# EAGLE design dds (EAGLE 7.7.0)

## Sheet 1 of 2
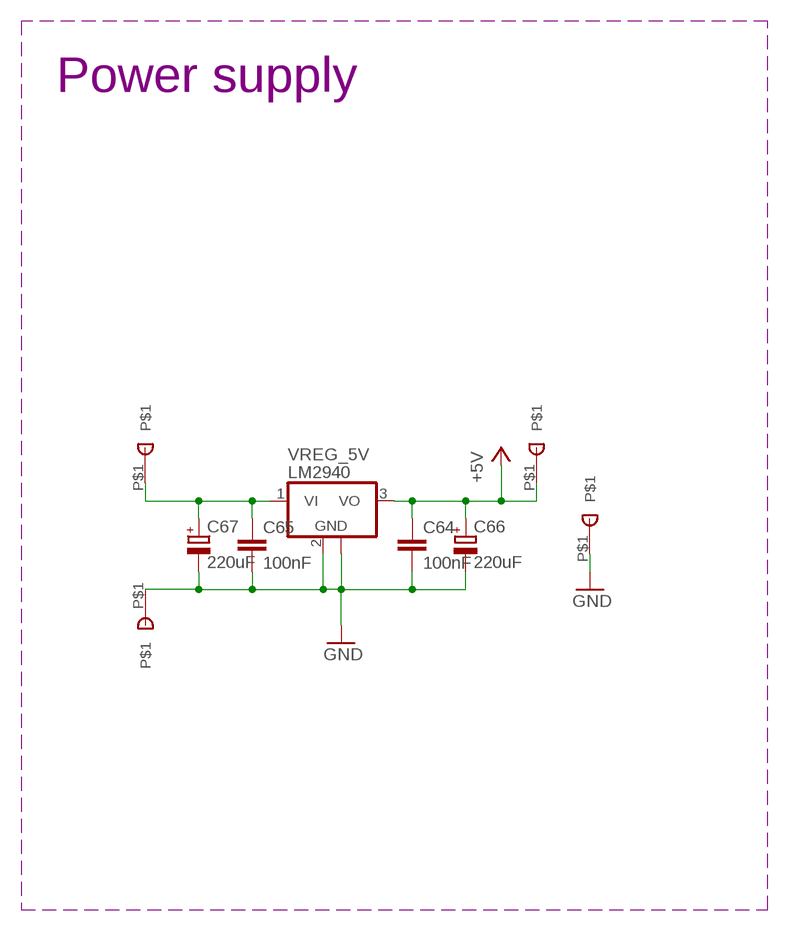
[diagram p0: schematic, sheet 1]

### Parts
C64  100nF  C-EUC0603  [C0603]
C65  100nF  C-EUC0603  [C0603]
C66  220uF  CPOL-EUCT7343  [CT7343]
C67  220uF  CPOL-EUCT7343  [CT7343]
U$3  SINGLE_SMD_CONN_2.5X3.5  [SMD_CONN_2.5X3.5]
U$8  SINGLE_SMD_CONN_2.5X3.5  [SMD_CONN_2.5X3.5]
U$22  SINGLE_SMD_CONN_1.5X1.5  [SMD_CONN_1.5X1.5]
U$23  SINGLE_SMD_CONN_1.5X1.5  [SMD_CONN_1.5X1.5]
VREG_5V  LM2940  UA78M05DCY  [SOT223]

### Nets
+5V: C64.1 C66.+ U$22.P$1 VREG_5V.3(VO) ; also sheet 2
GND: C64.2 C65.2 C66.- C67.- U$3.P$1 U$23.P$1 VREG_5V.2(GND) VREG_5V.4(GND) ; also sheet 2
VCC: C65.1 C67.+ U$8.P$1 VREG_5V.1(VI) ; also sheet 2

### Notes on the sheet
- Power supply

## Sheet 2 of 2
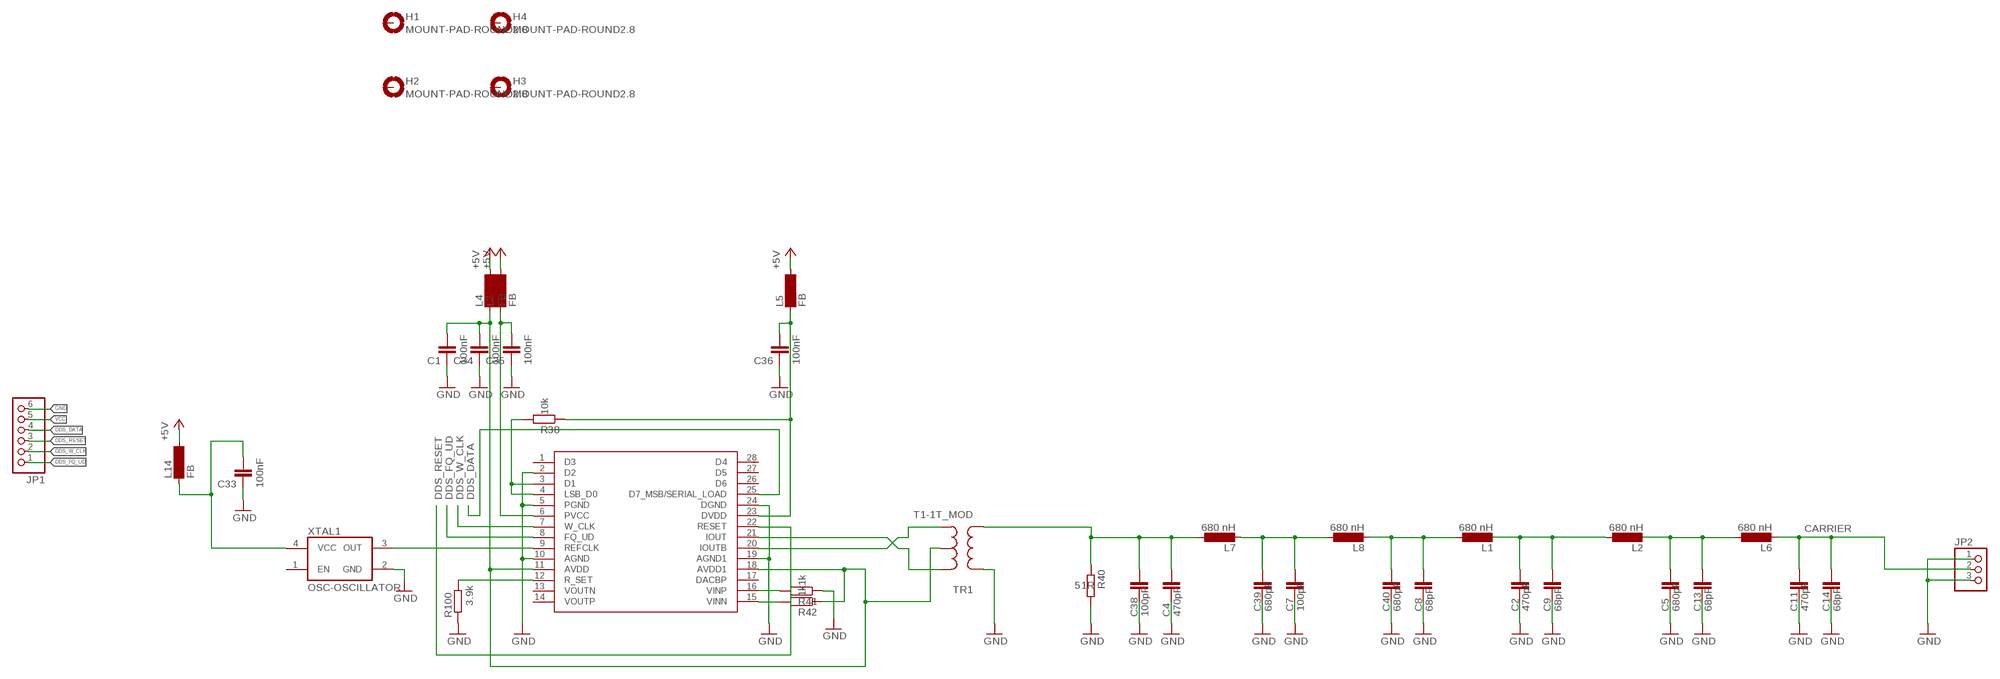
[diagram p1: schematic, sheet 2]

### Parts
C1  100nF  C-EUC0603K  [C0603K]
C2  470pF  C-EUC1206  [C1206]
C4  470pF  C-EUC1206  [C1206]
C5  680pF  C-EUC1206  [C1206]
C7  100pF  C-EUC1206  [C1206]
C8  68pF  C-EUC1206  [C1206]
C9  68pF  C-EUC1206  [C1206]
C11  470pF  C-EUC1206  [C1206]
C13  68pF  C-EUC1206  [C1206]
C14  68pF  C-EUC1206  [C1206]
C33  100nF  C-EUC0603K  [C0603K]
C34  100nF  C-EUC0603K  [C0603K]
C35  100nF  C-EUC0603K  [C0603K]
C36  100nF  C-EUC0603K  [C0603K]
C38  100pF  C-EUC1206  [C1206]
C39  680pF  C-EUC1206  [C1206]
C40  680pF  C-EUC1206  [C1206]
H1  MOUNT-PAD-ROUND2.8  [2,8-PAD]
H2  MOUNT-PAD-ROUND2.8  [2,8-PAD]
H3  MOUNT-PAD-ROUND2.8  [2,8-PAD]
H4  MOUNT-PAD-ROUND2.8  [2,8-PAD]
JP1  PINHD-1X6  [1X06]
JP2  PINHD-1X3  [1X03]
L1  680 nH  L-EUL1812  [L1812]
L2  680 nH  L-EUL1812  [L1812]
L3  FB  SM-1206  [SM-1206]
L4  FB  SM-1206  [SM-1206]
L5  FB  SM-1206  [SM-1206]
L6  680 nH  L-EUL1812  [L1812]
L7  680 nH  L-EUL1812  [L1812]
L8  680 nH  L-EUL1812  [L1812]
L14  FB  SM-1206  [SM-1206]
R38  10k  R-EU_R0603  [R0603]
R40  51R  R-EU_R0603  [R0603]
R41  1k  R-EU_R0603  [R0603]
R42  1k  R-EU_R0603  [R0603]
R100  3.9k  R-EU_R0603  [R0603]
TR1  T1-1T_MOD  [KK81_MOD]
U$9  AD9851BR  [TSSOP28]
XTAL1  OSC-OSCILLATOR  [OSCILLATOR_7X5_SMD]

### Nets
30MHZ: U$9.9(REFCLK) XTAL1.3(OUT)
+5V: L3.2 L4.2 L5.2 L14.2 ; also sheet 1
AVDD: C1.2 C34.2 L4.1 R42.1 TR1.5(ST) U$9.11(AVDD) U$9.18(AVDD1)
DDS_DATA: JP1.4 U$9.25(D7_MSB/SERIAL_LOAD)
DDS_FQ_UD: JP1.1 U$9.8(FQ_UD)
DDS_RESET: JP1.3 U$9.22(RESET)
DDS_W_CLK: JP1.2 U$9.7(W_CLK)
DDSOUT: C4.2 C38.2 L7.1 R40.1 TR1.3(P2)
DVDD: C36.2 L5.1 R38.1 U$9.23(DVDD)
FILTERED: C11.2 C14.2 JP2.2 L6.2
GND: C1.1 C2.1 C4.1 C5.1 C7.1 C8.1 C9.1 C11.1 C13.1 C14.1 C33.1 C34.1 C35.1 C36.1 C38.1 C39.1 C40.1 JP1.6 JP2.1 JP2.3 R40.2 R41.1 R100.1 TR1.1 U$9.2(D2) U$9.5(PGND) U$9.10(AGND) U$9.19(AGND1) U$9.24(DGND) XTAL1.2(GND) ; also sheet 1
N$1: C8.2 C40.2 L1.1 L8.2
N$2: C2.2 C9.2 L1.2 L2.1
N$3: TR1.4(S2) U$9.20(IOUTB)
N$6: C5.2 C13.2 L2.2 L6.1
N$68: R38.2 U$9.3(D1) U$9.4(LSB_D0)
N$70: TR1.6(S1) U$9.21(IOUT)
N$72: R41.2 U$9.16(VINP)
N$73: R42.2 U$9.15(VINN)
N$74: C7.2 C39.2 L7.2 L8.1
N$134: R100.2 U$9.12(R_SET)
PVCC: C35.2 L3.1 U$9.6(PVCC)
VCC: JP1.5 ; also sheet 1
VCC_OSC: C33.2 L14.1 XTAL1.4(VCC)
Unconnected: H1.B2,8(MOUNT) H2.B2,8(MOUNT) H3.B2,8(MOUNT) H4.B2,8(MOUNT) U$9.1(D3) U$9.13(VOUTN) U$9.14(VOUTP) U$9.17(DACBP) U$9.26(D6) U$9.27(D5) U$9.28(D4) XTAL1.1(EN)

### Notes on the sheet
- DDS_RESET | DDS_FQ_UD | DDS_W_CLK | DDS_DATA
- CARRIER

## Library data of the parts
C1 C2 C4 C5 C7-C9 C11 C13 C14 C33-C36 C38-C40 C64 C65 = rcl:C-EU: CAPACITOR, European symbol
C66 C67 = rcl:CPOL-EU: POLARIZED CAPACITOR, European symbol
H1-H4 = holes:MOUNT-PAD-ROUND: MOUNTING PAD, round
JP1 = pinhead:PINHD-1X6: PIN HEADER
JP2 = pinhead:PINHD-1X3: PIN HEADER
L1 L2 L6-L8 = resistor:L-EU: INDUCTOR, European symbol
L3-L5 L14 = inductor-neosid:SM-1206: INDUCTOR SMD chip inductor; OC_FARNELL: unknown; OC_NEWARK: unknown
R38 R40-R42 R100 = rcl:R-EU_: RESISTOR, European symbol
TR1 = minicir:T1-1T_MOD
U$3 U$8 = simple_smd_conn:SINGLE_SMD_CONN_2.5X3.5
U$9 = ad9851:AD9851: DDS
U$22 U$23 = simple_smd_conn:SINGLE_SMD_CONN_1.5X1.5
VREG_5V = linear:UA78M*: POSITIVE-VOLTAGE REGULATORS Source: http://focus.ti.com/lit/ds/symlink/ua78m33.pdf
XTAL1 = dp_devices:OSC-OSCILLATOR: Oscillator

## Board
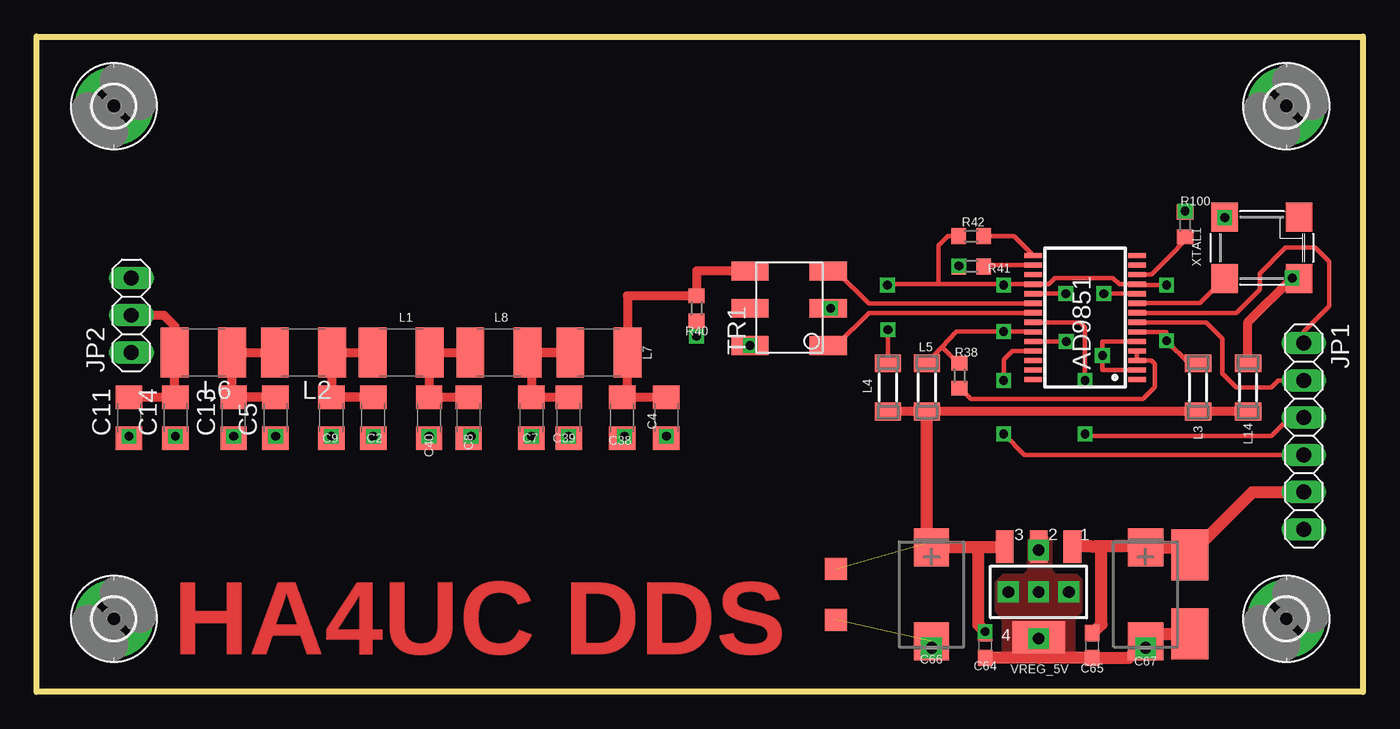
[diagram p2: board, top side]
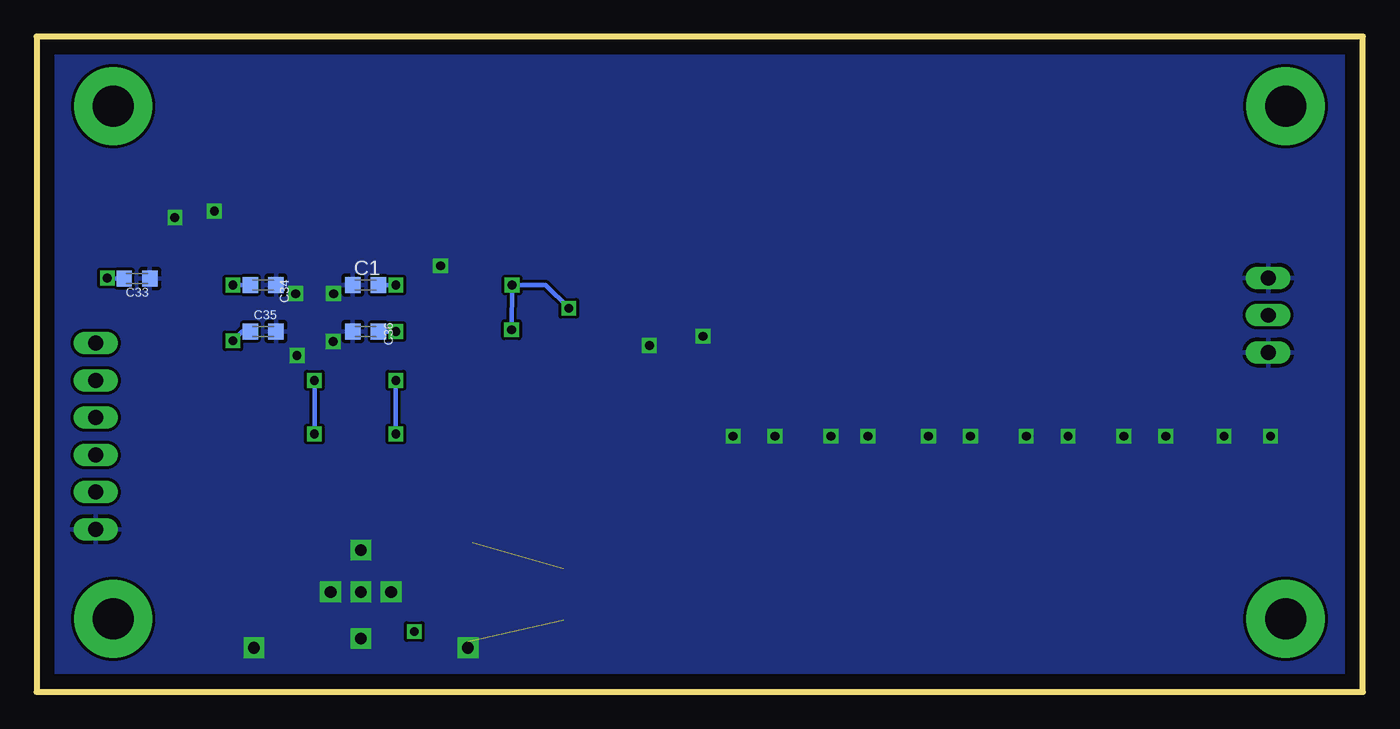
[diagram p3: board, bottom side, seen from below]

Size 90.5 x 44.74 mm. Coordinates in mm from the lower left corner, seen from the top.
Outline: 0,44.74 90.5,44.74 90.5,0 0,0 0,44.74
Copper layers (1*16): Top 0.035mm / dielectric 1.5mm / Bottom 0.035mm
Design rules "default *": minimum track width 0.15mm, minimum drill 24mil, track to track 8mil, track to pad 8mil, pad to pad 8mil, via to via 8mil, smd to smd 8mil, copper to edge 40mil, drill to drill 8mil, minimum pad ring 10mil, minimum via ring 8mil, stop-mask expansion 4mil, vias tented up to drill 0mil, thermal gap 10mil

### Footprints (pad centres in the part's own frame; a part is rotated, then mirrored left to right if it is on the bottom)
C0603K = smd 1.05 x 1.08: 1 -0.875,0; 2 0.875,0
C1206 = smd 1.6 x 1.8: 1 -1.4,0; 2 1.4,0
C0603 = smd 1.1 x 1: 1 -0.85,0; 2 0.85,0
CT7343 = smd 2.6 x 2.4: + -3.2,0; - 3.2,0
2,8-PAD = drill 2.8 pad 5.334: B2,8 0,0
1X06 = drill 1.016 long: 1 -6.35,0; 2 -3.81,0; 3 -1.27,0; 4 1.27,0; 5 3.81,0; 6 6.35,0
1X03 = drill 1.016 long: 1 -2.54,0; 2 0,0; 3 2.54,0
L1812 = smd 1.9 x 3.4: 1 -1.95,0; 2 1.95,0
SM-1206 = smd 1.2 x 1.8: 1 -1.65,0; 2 1.65,0
R0603 = smd 1 x 1.1: 1 -0.85,0; 2 0.85,0
KK81_MOD = smd 1.27 x 2.54: 1 -2.54,0.639; 2 0,0.639; 3 2.54,0.639; 4 2.54,-4.699; 5 0,-4.699; 6 -2.54,-4.699
SMD_CONN_2.5X3.5 = smd 3.5 x 2.5: P$1 0,0
TSSOP28 = smd 0.35 x 1.2: 1 -5.495,-2.9; 2 -4.845,-2.9; 3 -4.195,-2.9; 4 -3.545,-2.9; 5 -2.895,-2.9; 6 -2.245,-2.9; 7 -1.595,-2.9; 8 -0.945,-2.9; 9 -0.295,-2.9; 10 0.355,-2.9; 11 1.005,-2.9; 12 1.655,-2.9; 13 2.305,-2.9; 14 2.955,-2.9; 15 2.955,4.17; 16 2.305,4.17; 17 1.655,4.17; 18 1.005,4.17; 19 0.355,4.17; 20 -0.295,4.17; 21 -0.945,4.17; 22 -1.595,4.17; 23 -2.245,4.17; 24 -2.895,4.17; 25 -3.545,4.17; 26 -4.195,4.17; 27 -4.845,4.17; 28 -5.495,4.17
SMD_CONN_1.5X1.5 = smd 1.5 x 1.5: P$1 0,0
SOT223 = smd 1.219 x 2.235: 1 -2.311,-3.099; 2 0,-3.099; 3 2.311,-3.099 | smd 3.6 x 2.2: 4 0,3.099
OSCILLATOR_7X5_SMD = smd 1.8 x 2: 1 -2.54,-2.1; 2 2.54,-2.1; 3 2.54,2.1; 4 -2.54,2.1

### Placement (x,y rotation side)
C1  68.06,27.78 0 bottom
C2  22.97,18.73 90 top
C4  42.97,18.73 90 top
C5  16.3,18.73 90 top
C7  33.77,18.73 90 top
C8  29.48,18.73 90 top
C9  20.11,18.73 90 top
C11  6.3,18.73 90 top
C13  13.45,18.73 90 top
C14  9.48,18.73 90 top
C33  83.65,28.22 180 bottom
C34  75.04,27.78 180 bottom
C35  75.04,24.61 180 bottom
C36  68.06,24.61 0 bottom
C38  39.96,18.73 90 top
C39  36.31,18.73 90 top
C40  26.78,18.73 90 top
C64  64.72,3.18 270 top
C65  72.03,3.18 270 top
C66  61.07,6.67 270 top
C67  75.68,6.67 270 top
H1  85.27,40 0 top
H2  5.27,40 0 top
H3  5.27,5 0 top
H4  85.27,5 0 top
JP1  86.47,17.47 270 top
JP2  6.46,25.72 90 top
L1  24.88,23.18 180 top
L2  18.21,23.18 180 top
L3  79.25,20.8 270 top
L4  58.09,20.8 270 top
L5  60.75,20.8 270 top
L6  11.38,23.18 180 top
L7  38.37,23.18 180 top
L8  31.54,23.18 180 top
L14  82.66,20.8 270 top
R38  62.98,21.59 270 top
R40  45.04,26.2 270 top
R41  63.77,29.05 0 top
R42  63.77,31.12 0 top
R100  78.38,31.91 270 top
TR1  49.32,26.2 90 top
U$3  78.69,3.97 270 top
U$8  78.69,9.37 270 top
U$9  72.18,26.83 90 top
U$22  54.56,8.42 90 top
U$23  54.56,4.92 90 top
VREG_5V  68.37,6.83 180 top
XTAL1  83.61,30.32 180 top

### Tracks (layer width: path | path; a pad name or v marks a point on that pad's centre or on a via)
30MHZ
  Top 0.305: 81.01,28.28 XTAL1.3 79.39,26.54 U$9.9
+5V  (via drill 0.6 pad 0.61)  (1 unrouted)
  Top 0.305: VREG_5V.3 66.06,9.87 | v64.72,4.13 C64.1
  Top 0.61: L4.2 L5.2 L3.2 L14.2
  Top 0.813: 66.06,9.87 64.25,9.87 | 64.25,9.87 C66.+ 60.75,10.19 L5.2 | 64.25,9.87 64.25,4.61 v64.72,4.13
AVDD  (via drill 0.6)
  Top 0.305: U$9.11 75.1,27.82 | TR1.5 v54.18,26.2 | 61.55,27.84 65.99,27.84 | 65.99,27.84 U$9.18 69.06,27.84 69.48,28.26 73.45,28.26 73.88,27.84 U$9.11 | v65.99,27.78 65.99,27.84 | L4.1 v58.09,24.73 | R42.1 62.18,31.12 61.55,30.48 61.55,27.84 | U$9.11 75.14,27.78 v77.1,27.78 | 61.55,27.84 58.05,27.84 v58.05,27.78
  Bottom 0.305: C1.2 v65.99,27.78 | v58.09,24.73 v58.05,27.78 55.77,27.78 v54.18,26.2 | C34.2 v77.1,27.78
DDS_DATA  (via drill 0.6)
  Top 0.305: U$9.25 66.57,23.29 65.99,22.7 v65.99,21.27 | v65.99,17.62 67.42,16.2 JP1.4
  Bottom 0.305: v65.99,21.27 v65.99,17.62
DDS_FQ_UD
  Top 0.305: U$9.8 81.87,25.89 83.45,27.47 83.45,28.58 85.2,30.32 87.26,30.32 88.22,29.37 88.22,26.35 86.47,24.61 JP1.1
DDS_RESET  (via drill 0.6)
  Top 0.305: U$9.22 71.24,25.24 71.55,24.93 v71.55,21.27 | v71.55,17.62 71.71,17.47 84.25,17.47 85.52,18.73 JP1.3
  Bottom 0.305: v71.55,21.27 v71.55,17.62
DDS_W_CLK
  Top 0.305: U$9.7 79.81,25.24 80.91,24.13 80.91,21.75 81.87,20.8 84.25,20.8 84.72,21.27 JP1.2
DDSOUT
  Top 0.61: C4.2 C38.2 40.32,20.13 L7.1 40.32,27.05 R40.1 45.04,28.74 TR1.3
DVDD  (via drill 0.6)
  Top 0.305: U$9.23 67.99,24.61 v65.99,24.61 62.75,24.61 61.78,23.55 | 61.78,23.55 L5.1 | R38.1 62.89,22.44 61.78,23.55
  Bottom 0.305: v65.99,24.61 C36.2
FILTERED
  Top 0.61: C11.2 C14.2 9.43,20.13 L6.2 9.43,24.97 8.68,25.72 JP2.2
GND  (via drill 0.6, 0.6 pad 1.02, 0.8 pad 1.42)  (1 unrouted)
  Top 0.305: U$9.2 72.74,21.99 v72.74,22.98 72.74,23.93 U$9.5 | U$9.24 v70.28,23.94 v70.28,23.93 | U$9.19 v70.24,27.19 | 68.37,2.33 v68.37,3.65 VREG_5V.4 | C67.- 75.68,3.97 | C66.- v61.07,3.02 61.07,3.5 | v72.82,27.19 U$9.10 | v68.37,9.69 VREG_5V.2 | R100.1 v78.37,32.82 v78.38,32.82 | R41.1 62.98,29.05 v62.94,29.09 | XTAL1.2 v81.07,32.39 | C11.1 v6.3,17.47 | C14.1 v9.48,17.47 | C13.1 v13.45,17.47 | C5.1 v16.3,17.47 | C9.1 v20.11,17.47 | C2.1 v22.97,17.47 | C40.1 v26.78,17.47 | C8.1 29.61,17.47 v29.64,17.47 | C7.1 v33.77,17.47 | C39.1 v36.31,17.47 | C38.1 40.09,17.47 v40.12,17.47 | C4.1 v42.97,17.47
  Top 0.61: TR1.1 | v45.04,24.29 R40.2
  Top 0.813: C67.- 74.53,2.33 C65.2 68.37,2.33 C64.2 | 75.68,3.97 U$3.P$1
  other vias: 70.44,6.83 68.37,6.83 66.31,6.83 48.69,23.66 75.68,3.02
  pour Top (isolate 0.203, no thermals): 70.75,2.38 70.75,5.08 71.23,5.56 71.23,7.62 70.91,7.94 69.48,7.94 69.17,8.26 69.17,10.32 68.85,10.64 68.06,10.64 67.74,10.32 67.74,8.26 67.42,7.94 65.99,7.94 65.52,7.46 65.52,5.56 65.99,5.08 65.99,2.38
  pour Bottom: -12.94,64.47 -12.94,-36.73 105.23,-36.73 105.23,64.47
N$1
  Top 0.61: L8.2 L1.1 26.83,20.13 C40.2 C8.2
N$2
  Top 0.61: L1.2 L2.1 20.16,20.13 C2.2 C9.2
N$3
  Top 0.305: TR1.4 54.56,28.74 56.78,26.51 67.99,26.51 U$9.20
N$6
  Top 0.61: L2.2 L6.1 13.33,20.13 C5.2 C13.2
N$68
  Top 0.305: U$9.4 U$9.3 76.06,22.64 76.31,22.39 76.31,20.84 75.48,20.01 63.77,20.01 63.03,20.74 R38.2
N$70
  Top 0.305: TR1.6 54.56,23.66 56.78,25.88 68.01,25.88 U$9.21
N$72
  Top 0.305: U$9.16 65.17,29.14 R41.2
N$73
  Top 0.305: R42.2 66.68,31.12 U$9.15
N$74
  Top 0.61: L8.1 L7.2 33.77,23.18 C7.2 C39.2
N$134
  Top 0.305: U$9.12 76.06,28.49 77.26,29.69 78.48,30.96 R100.2
PVCC  (via drill 0.6)
  Top 0.305: U$9.6 77.1,24.59 v77.1,23.97 78.63,22.45 L3.1
  Bottom 0.305: C35.2 76.47,24.61 v77.1,23.97
VCC
  Top 0.305: 75.62,9.93 C67.+ 75.68,9.84 | 72.18,9.93 72.02,9.93
  Top 0.813: 75.62,9.93 72.5,9.93 | 72.5,9.93 72.18,9.93 | 72.02,9.93 VREG_5V.1 | C65.1 72.08,4.03 72.66,4.61 72.66,9.77 72.5,9.93 | C67.+ 78.19,9.87 U$8.P$1 82.98,13.66 JP1.5
VCC_OSC  (via drill 0.6)
  Top 0.305: XTAL1.4 85.71,28.22 v85.68,28.26
  Top 0.61: L14.1 82.66,25.24 v85.68,28.26
  Bottom 0.305: C33.2 85.64,28.22 v85.68,28.26

### Text on the board
Top: HA4UC DDS